# EAGLE design 4th_MFB_LPF (EAGLE 7.2.0)
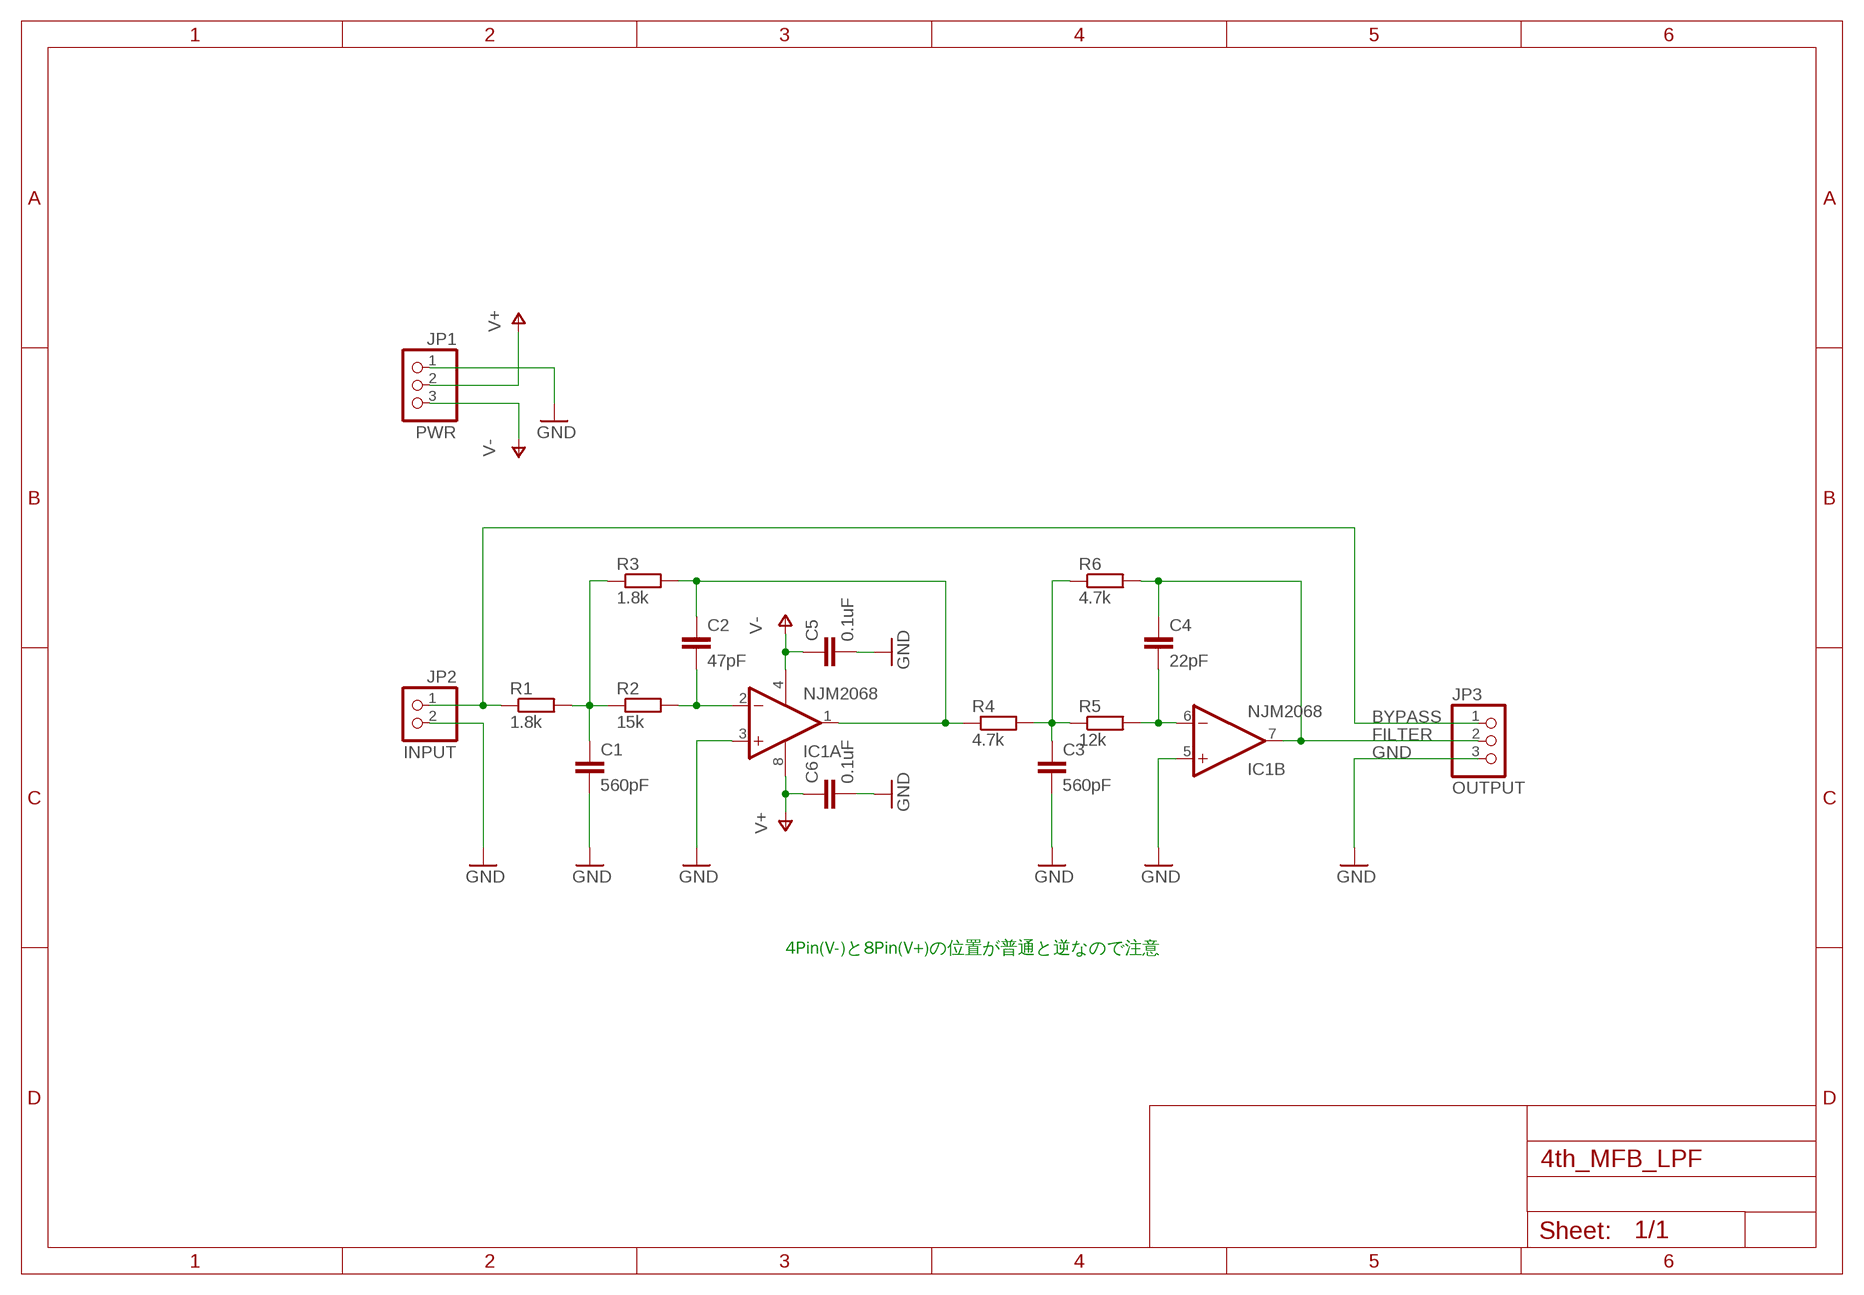
[diagram p0: schematic, sheet 1]

## Parts
C1  560pF  C-EU050-030X075  [C050-030X075]
C2  47pF  C-EU050-030X075  [C050-030X075]
C3  560pF  C-EU050-030X075  [C050-030X075]
C4  22pF  C-EU050-030X075  [C050-030X075]
C5  0.1uF  C-EU025-024X044  [C025-024X044]
C6  0.1uF  C-EU050-024X044  [C050-024X044]
IC1  NJM2068  LM358N  [DIL08]
JP1  PWR  PINHD-1X3  [1X03]
JP2  INPUT  PINHD-1X2  [1X02]
JP3  OUTPUT  PINHD-1X3  [1X03]
R1  1.8k  R-EU_0207/7  [0207/7]
R2  15k  R-EU_0207/7  [0207/7]
R3  1.8k  R-EU_0207/7  [0207/7]
R4  4.7k  R-EU_0207/7  [0207/7]
R5  12k  R-EU_0207/7  [0207/7]
R6  4.7k  R-EU_0207/7  [0207/7]

## Nets
BYPASS: JP2.1 JP3.1 R1.1
FILTER: C4.1 IC1.7(B:OUT) JP3.2 R6.2
GND: C1.2 C3.2 C5.2 C6.2 IC1.3(A:+IN) IC1.5(B:+IN) JP1.1 JP2.2 JP3.3
N$2: C1.1 R1.2 R2.1 R3.1
N$3: C2.2 IC1.2(A:-IN) R2.2
N$4: C2.1 IC1.1(A:OUT) R3.2 R4.1
N$8: C3.1 R4.2 R5.1 R6.1
N$10: C4.2 IC1.6(B:-IN) R5.2
V+: C6.1 IC1.8(P:V+) JP1.2
V-: C5.1 IC1.4(P:V-) JP1.3

## Notes on the sheet
- 4Pin(V-)と8Pin(V+)の位置が普通と逆なので注意

## Library data of the parts
C1-C6 = rcl:C-EU: CAPACITOR, European symbol
IC1 = linear:LM358: OP AMP also LM158; LM258; LM2904 Source: http://cache.national.com/ds/LM/LM158.pdf
JP1 JP3 = pinhead:PINHD-1X3: PIN HEADER
JP2 = pinhead:PINHD-1X2: PIN HEADER
R1-R6 = rcl:R-EU_: RESISTOR, European symbol

## Board
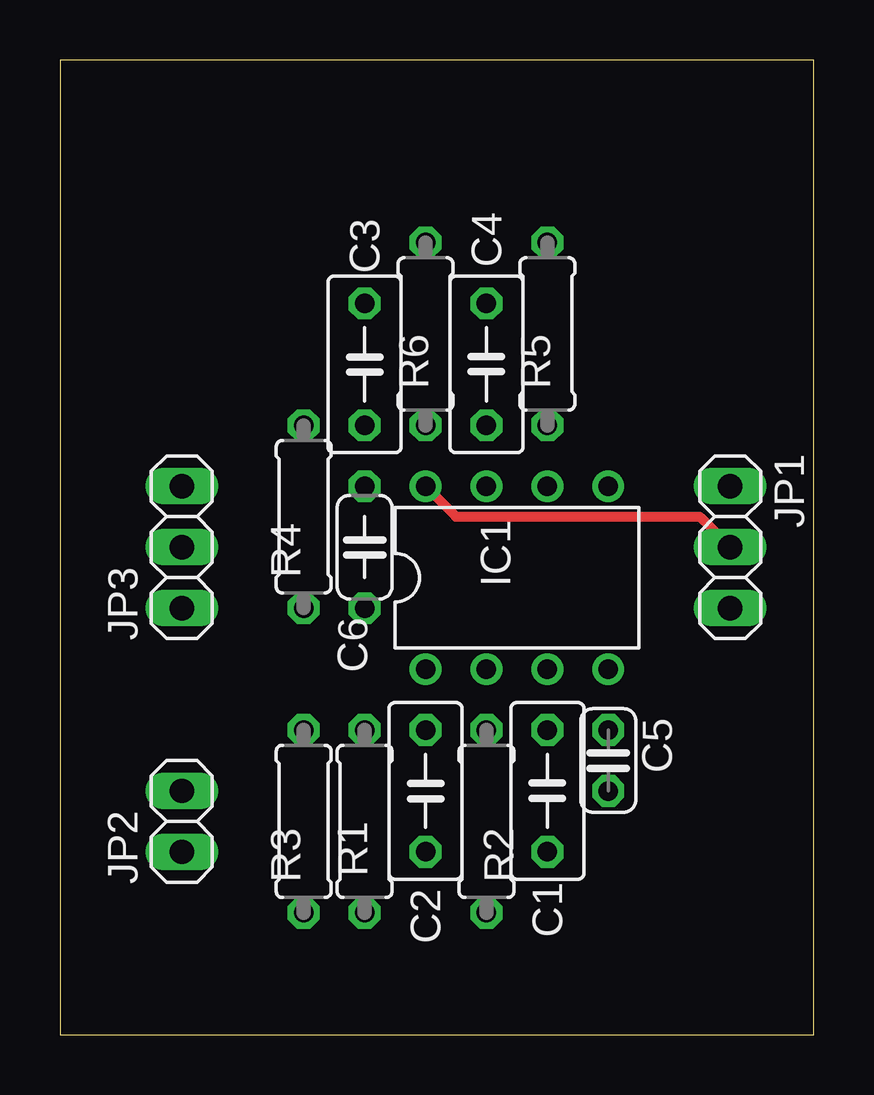
[diagram p1: board, top side]
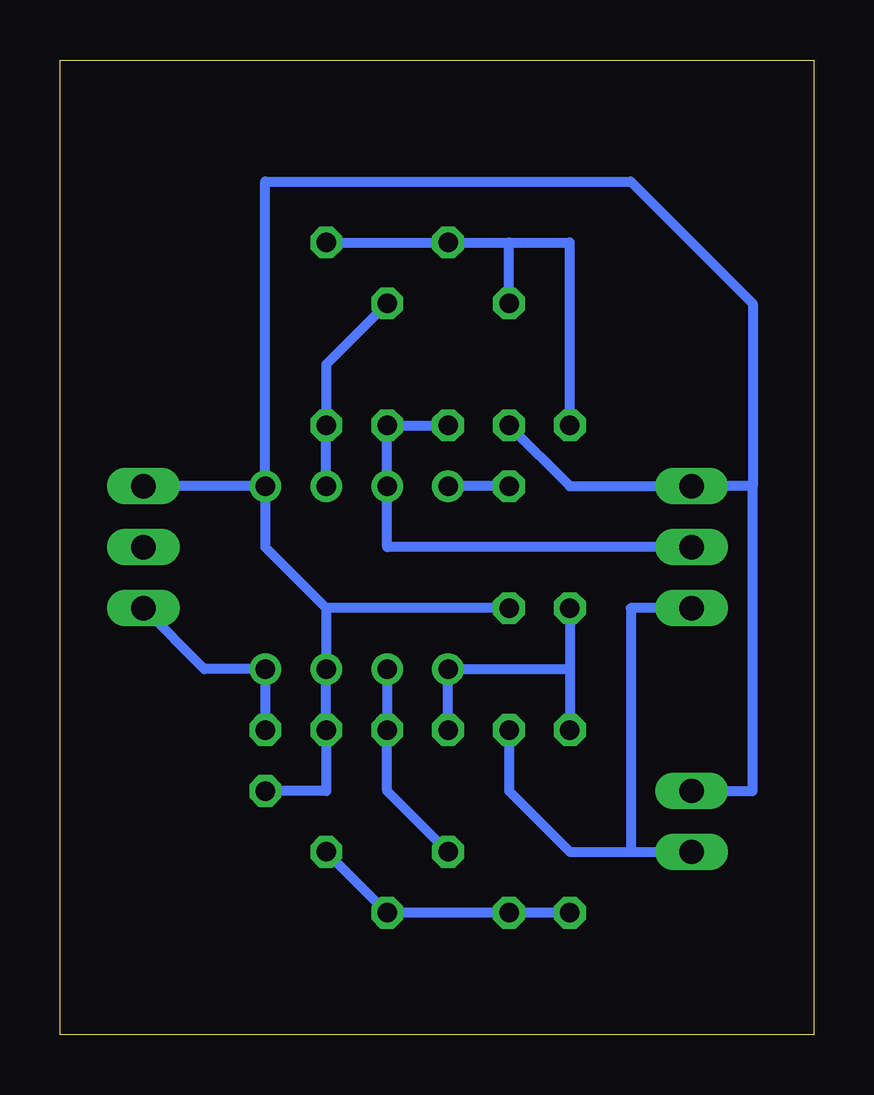
[diagram p2: board, bottom side, seen from below]

Size 31.42 x 40.63 mm. Coordinates in mm from the lower left corner, seen from the top.
Outline: 0,0 31.42,0 31.42,40.63 0,40.63 0,0
Copper layers (1*16): Top 0.035mm / dielectric 1.5mm / Bottom 0.035mm
Design rules "default": minimum track width 10mil, minimum drill 24mil, track to track 8mil, track to pad 8mil, pad to pad 8mil, via to via 8mil, smd to smd 8mil, copper to edge 40mil, drill to drill 8mil, minimum pad ring 10mil, minimum via ring 8mil, stop-mask expansion 4mil, vias tented up to drill 0mil, thermal gap 10mil

### Footprints (pad centres in the part's own frame; a part is rotated, then mirrored left to right if it is on the bottom)
C050-030X075 = drill 0.813 octagon: 1 -2.54,0; 2 2.54,0
C025-024X044 = drill 0.813 octagon: 1 -1.27,0; 2 1.27,0
C050-024X044 = drill 0.813 octagon: 1 -2.54,0; 2 2.54,0
DIL08 = drill 0.813 pad 1.27: 1 -3.81,-3.81; 2 -1.27,-3.81; 3 1.27,-3.81; 4 3.81,-3.81; 5 3.81,3.81; 6 1.27,3.81; 7 -1.27,3.81; 8 -3.81,3.81
1X03 = drill 1.016 long: 1 -2.54,0; 2 0,0; 3 2.54,0
1X02 = drill 1.016 long: 1 -1.27,0; 2 1.27,0
0207/7 = drill 0.813 octagon: 1 -3.81,0; 2 3.81,0

### Placement (x,y rotation side)
C1  20.32,10.16 90 top
C2  15.24,10.16 270 top
C3  12.7,27.94 270 top
C4  17.78,27.94 90 top
C5  22.86,11.43 270 top
C6  12.7,20.32 270 top
IC1  19.05,19.05 0 top
JP1  27.94,20.32 270 top
JP2  5.08,8.89 90 top
JP3  5.08,20.32 90 top
R1  12.7,8.89 270 top
R2  17.78,8.89 90 top
R3  10.16,8.89 90 top
R4  10.16,21.59 90 top
R5  20.32,29.21 270 top
R6  15.24,29.21 270 top

### Tracks (layer width: path | path; a pad name or v marks a point on that pad's centre or on a via)
BYPASS
  Bottom 0.406: JP3.1 7.62,17.78 7.62,7.62 | 7.62,7.62 JP2.1 | R1.1 12.7,10.16 10.16,7.62 7.62,7.62
FILTER
  Bottom 0.406: R6.2 C4.1 IC1.7 17.78,20.32 JP3.2
GND
  Bottom 0.406: C3.2 10.16,22.86 JP3.3 2.54,22.86 | JP2.2 2.54,10.16 2.54,22.86 | C6.2 20.32,17.78 | 20.32,17.78 IC1.3 C1.2 20.32,10.16 C5.2 | IC1.5 22.86,20.32 20.32,17.78 | IC1.5 22.86,35.56 7.62,35.56 2.54,30.48 2.54,22.86 | IC1.5 JP1.1
N$2
  Bottom 0.406: R3.1 R1.2 R2.1 C1.1
N$3
  Bottom 0.406: IC1.2 R2.2 17.78,10.16 C2.2
N$4
  Bottom 0.406: R4.1 10.16,15.24 | 10.16,15.24 R3.2 | 10.16,15.24 IC1.1 C2.1
N$8
  Bottom 0.406: R4.2 10.16,33.02 12.7,33.02 | R5.1 R6.1 12.7,33.02 | C3.1 12.7,33.02
N$10
  Bottom 0.406: IC1.6 R5.2 20.32,27.94 C4.2
V+
  Top 0.406: IC1.8 16.51,21.59 26.67,21.59 JP1.2
  Bottom 0.406: C6.1 IC1.8
V-
  Bottom 0.406: JP1.3 25.4,15.24 IC1.4 C5.1